# Altium schematic sheet 按键接口.SchDoc
size A4
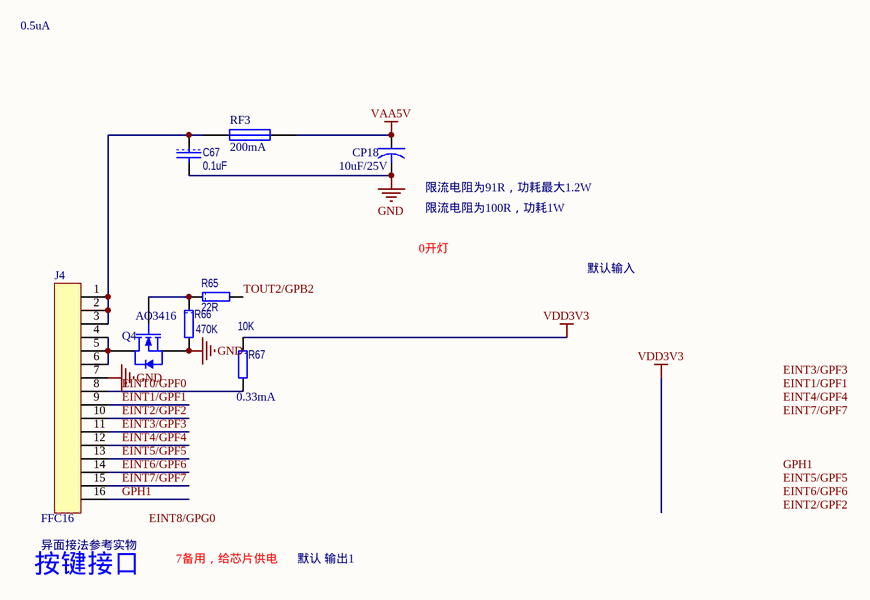
[diagram p0: 按键接口.SchDoc]

## Parts
C67  0.1uF  [1608[0603]]
CP18  10uF/25V  [6032[2312]CC]
J4  FFC16  [FFC/SM0.5-2H16]
Q4  AO3416  [SOT23_N]
R65  22R  [1608[0603]R]
R66  470K  [1608[0603]R]
R67  10K  [1608[0603]R]
RF3  value 200mA  [2012[0805]F]  (hidden comment: NanoSMDC020F)

## Nets
GND: C67.2 CP18.2 J4.7 Q4.2(S) R66.2
VAA5V: CP18.1 RF3.2
VDD3V3: R67.1
EINT0/GPF0: J4.8 R67.2
EINT1/GPF1: J4.9
EINT2/GPF2: J4.10
EINT3/GPF3: J4.11
EINT4/GPF4: J4.12
EINT5/GPF5: J4.13
EINT6/GPF6: J4.14
EINT7/GPF7: J4.15
GPH1: J4.16
TOUT2/GPB2: R65.2
NetC67_1: C67.1 J4.1 J4.2 J4.3 RF3.1
NetJ4_4: J4.4 J4.5 J4.6 Q4.3(D)
NetQ4_1: Q4.1(G) R65.1 R66.1

## Notes on the sheet
- 0.5uA
- (near CP18) 限流电阻为91R，功耗最大1.2W
- 0开灯
- (near CP18) 限流电阻为100R，功耗1W
- 默认输入
- (near R67) 0.33mA
- (near J4) 按键接口
- (near J4) 异面接法参考实物
- 7备用，给芯片供电
- 默认 输出1
- Labels drawn without touching a wire or pin: EINT1/GPF1, EINT2/GPF2, EINT3/GPF3, EINT4/GPF4, EINT5/GPF5, EINT6/GPF6, EINT7/GPF7, EINT8/GPG0, GPH1

## Library data of the parts
C67 = CAP: Capacitor; Manufacturer: TDK; Type: 无铅电容; Model: C0603X7R1H104K; Value: 0.1uF
CP18 = CAPACITOR: Tantalum Capacitor; Compy: TAJ; name: TAJ-A-106-M-010-R
J4 = 16PIN: CON
Q4 = 2N7002: NMOS; Published: 17-Sep-2003; LatestRevisionDate: 12-Dec-2006; LatestRevisionNote: IPC-7351 Footprint Added.; DatasheetVersion: 27-Jul-2000; PackageVersion: May-1999; PackageReference: SOT23; Publisher: Altium Limited; PackageDescription: 3-Pin SOT-23 Package 0.95 mm Pitch, 2.3 mm Lead Span; ComponentLink1Description: Manufacturer Link; ComponentLink1URL: http://www.semiconductors.philips.com/; ComponentLink2Description: Datasheet; ComponentLink2URL: http://www.semiconductors.philips.com/acrobat/datasheets/2N7002_4.pdf
R65 = RES: Manufacturer: vishay; Model: CRCW060322R0KKEDTR; Parameters: 50V 1/10W 0.5%; Type: 无铅电阻; Value: 22R
R66 = RES: Manufacturer: vishay; Model: CRCW0603470K0KKEDTR; Parameters: 50V 1/10W 0.5%; Type: 无铅电阻; Value: 470K
R67 = RES: Manufacturer: vishay; Model: CRCW060310K0KKEDTR; Parameters: 50V 1/10W 0.5%; Type: 无铅电阻; Value: 10K
RF3 = FUSE1: FUSE; 公司: 美国泰科